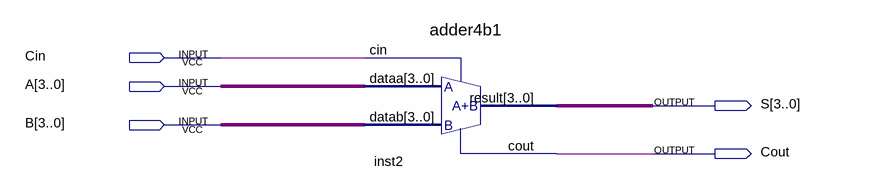
[diagram p0: schematic sheet]
// Quartus schematic adder4b.bdf as structural Verilog: 1 symbols, 5 pins
module adder4b (
  input  Cin,
  input  [3:0] A,
  input  [3:0] B,
  output [3:0] S,
  output Cout
);

  adder4b1 inst2 (.dataa(A), .datab(B), .cin(Cin), .result(S), .cout(Cout));
endmodule
